# EAGLE design turntouch-remote-master (EAGLE 7.3.0)
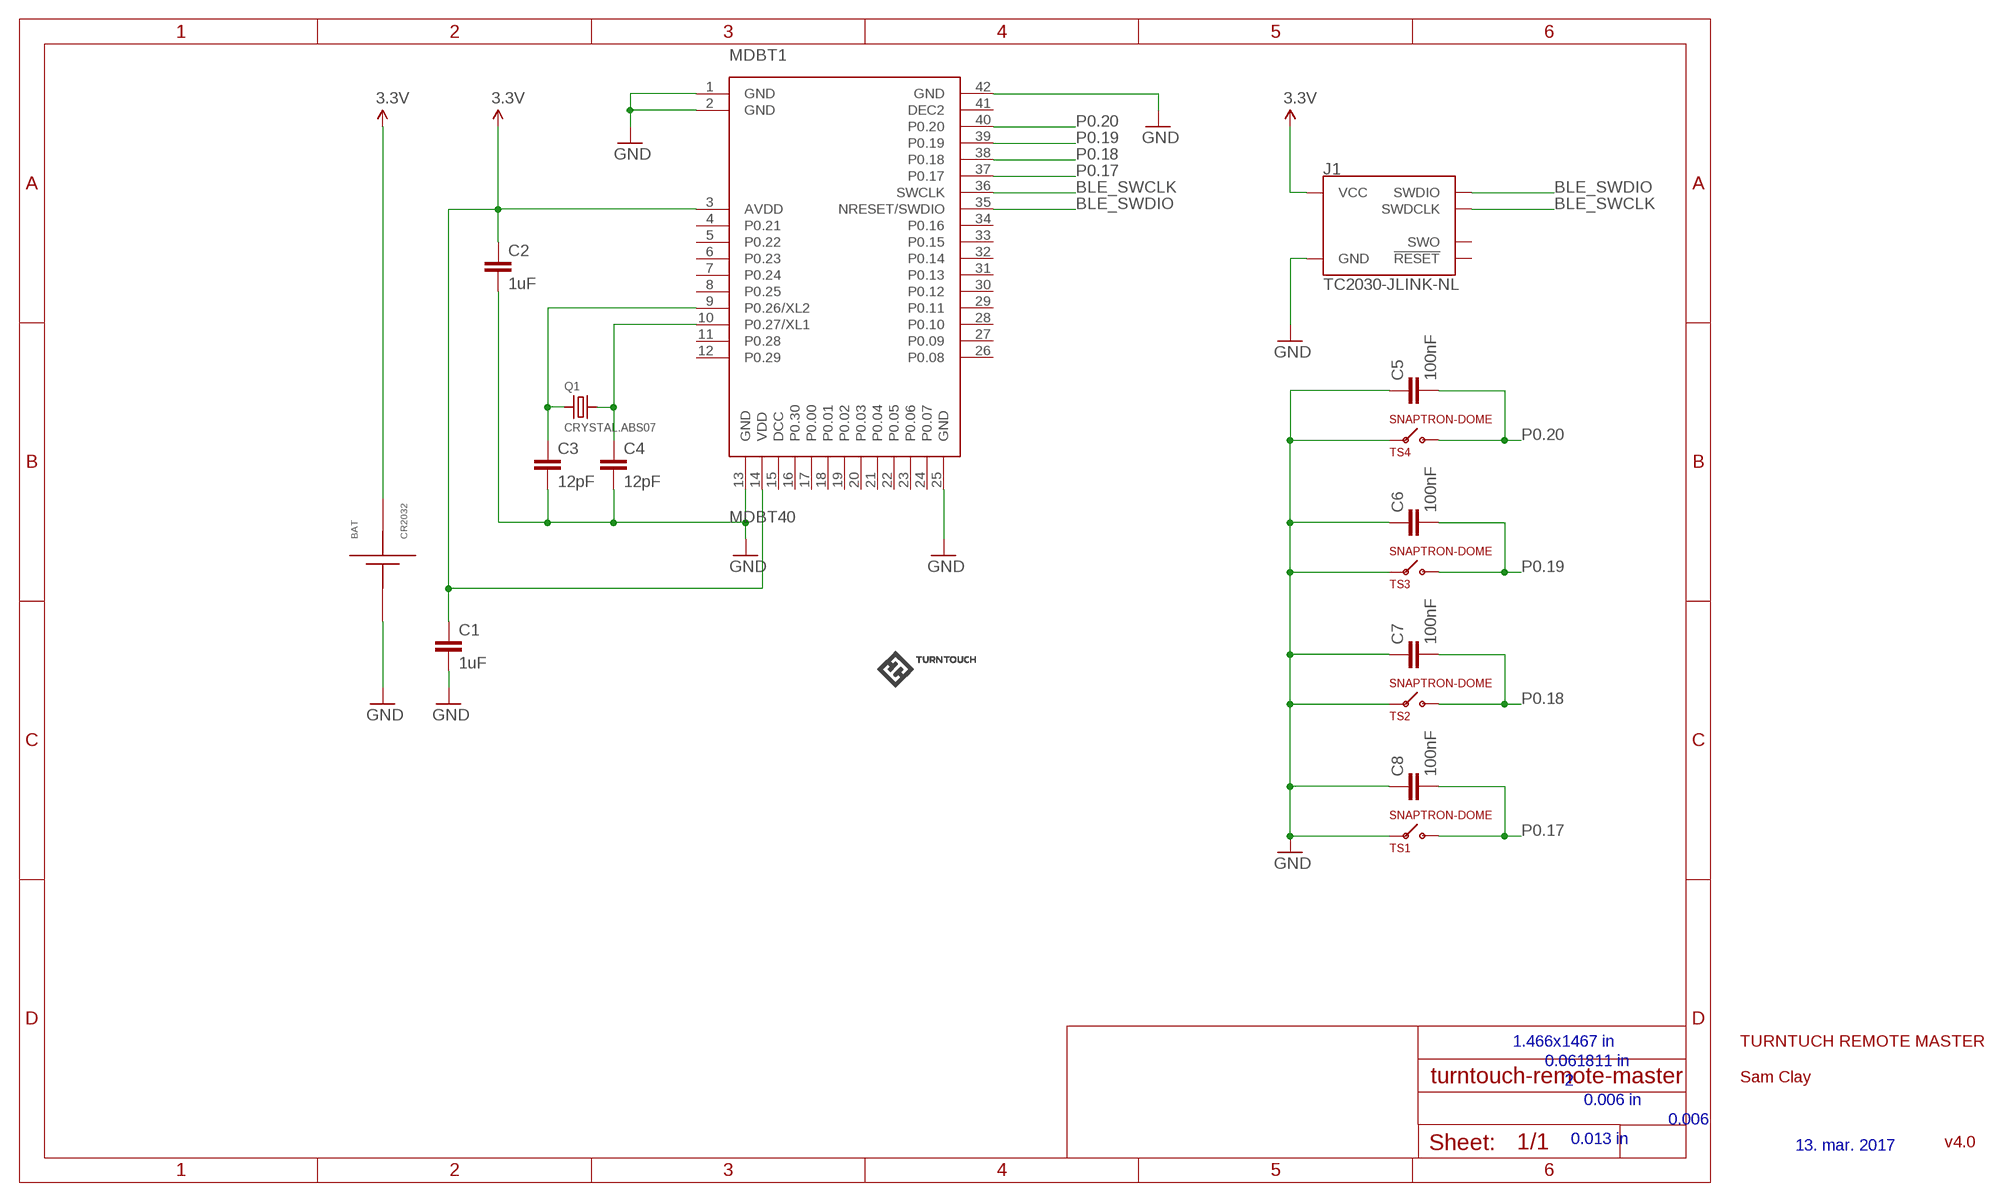
[diagram p0: schematic, sheet 1]

## Parts
BAT  CR2032  [CR2032]
C1  1uF  0.1UF-25V(+80/-20%)(0603)  [0603-CAP]
C2  1uF  0.1UF-25V(+80/-20%)(0603)  [0603-CAP]
C3  12pF  0.1UF-25V(+80/-20%)(0603)  [0603-CAP]
C4  12pF  0.1UF-25V(+80/-20%)(0603)  [0603-CAP]
C5  100nF  0.1UF-25V(+80/-20%)(0603)  [0603-CAP]
C6  100nF  0.1UF-25V(+80/-20%)(0603)  [0603-CAP]
C7  100nF  0.1UF-25V(+80/-20%)(0603)  [0603-CAP]
C8  100nF  0.1UF-25V(+80/-20%)(0603)  [0603-CAP]
J1  TC2030-JLINK-NL  [TC2030-IDC-NL]
LOGO  TURNTOUCHLOGO200DPI  [LOGO]
MDBT1  MDBT40  [MDBT40]
Q1  CRYSTAL.ABS07  [ABS07]
TS1  SNAPTRON-DOME  [DOME-M-SERIES]
TS2  SNAPTRON-DOME  [DOME-M-SERIES]
TS3  SNAPTRON-DOME  [DOME-M-SERIES]
TS4  SNAPTRON-DOME  [DOME-M-SERIES]

## Nets
3.3V [power]: BAT.P$1(VBAT) BAT.P$2(VBAT) C1.1 C2.1 J1.1(VCC) MDBT1.3(AVDD) MDBT1.14(VDD)
BLE_SWCLK: J1.4(SWDCLK) MDBT1.36(SWCLK)
BLE_SWDIO: J1.2(SWDIO) MDBT1.35(NRESET/SWDIO)
C5: C4.1 MDBT1.10(P0.27/XL1) Q1.2
GND: BAT.GND C1.2 C2.2 C3.2 C4.2 C5.1 C6.1 C7.1 C8.1 J1.5(GND) MDBT1.1(GND) MDBT1.2(GND) MDBT1.13(GND) MDBT1.25(GND) MDBT1.42(GND) TS1.P$1(V) TS1.P$2(V) TS2.P$1(V) TS2.P$2(V) TS3.P$1(V) TS3.P$2(V) TS4.P$1(V) TS4.P$2(V)
N$13: C3.1 MDBT1.9(P0.26/XL2) Q1.1
P0.17: C8.2 MDBT1.37(P0.17) TS1.P$3(B)
P0.18: C7.2 MDBT1.38(P0.18) TS2.P$3(B)
P0.19: C6.2 MDBT1.39(P0.19) TS3.P$3(B)
P0.20: C5.2 MDBT1.40(P0.20) TS4.P$3(B)
Unconnected: J1.3(!RESET) J1.6(SWO) MDBT1.4(P0.21) MDBT1.5(P0.22) MDBT1.6(P0.23) MDBT1.7(P0.24) MDBT1.8(P0.25) MDBT1.11(P0.28) MDBT1.12(P0.29) MDBT1.15(DCC) MDBT1.16(P0.30) MDBT1.17(P0.00) MDBT1.18(P0.01) MDBT1.19(P0.02) MDBT1.20(P0.03) MDBT1.21(P0.04) MDBT1.22(P0.05) MDBT1.23(P0.06) MDBT1.24(P0.07) MDBT1.26(P0.08) MDBT1.27(P0.09) MDBT1.28(P0.10) MDBT1.29(P0.11) MDBT1.30(P0.12) MDBT1.31(P0.13) MDBT1.32(P0.14) MDBT1.33(P0.15) MDBT1.34(P0.16) MDBT1.41(DEC2)

## Notes on the sheet
- 1.466x1467 in | TURNTUCH REMOTE MASTER
- 0.061811 in
- 2 | Sam Clay
- 0.006 in
- 0.006
- 0.013 in | v4.0
- 13. mar. 2017

## Library data of the parts
BAT = cr2032:CR2032
C1-C8 = SparkFun-Capacitors:0.1UF-25V(+80/-20%)(0603): CAP-00810 Ceramic Standard decoupling cap; PROD_ID: CAP-00810; VALUE: 0.1uF
J1 = connector:TC2030-JLINK
LOGO = remote:TURNTOUCHLOGO
MDBT1 = MDBT40_170726:MDBT40: Raytac Corporation MDBT40-256V3(16Kb), MDBT40-P256V3(16Kb), MDBT40-256RV3(32Kb), MDBT40-P256RV3(32Kb), Bluetooth Low Energy Module based on Noridc nRF51822 Source: Raytac datasheet
Q1 = abracon:CRYSTAL
TS1-TS4 = remote:SNAPTRON-DOME

## Net classes
0 default: width 0.102 mm, drill 0.203 mm, clearance 0.102 mm
1 power: width 0.254 mm, drill 0.33 mm, clearance 0.152 mm

## Board
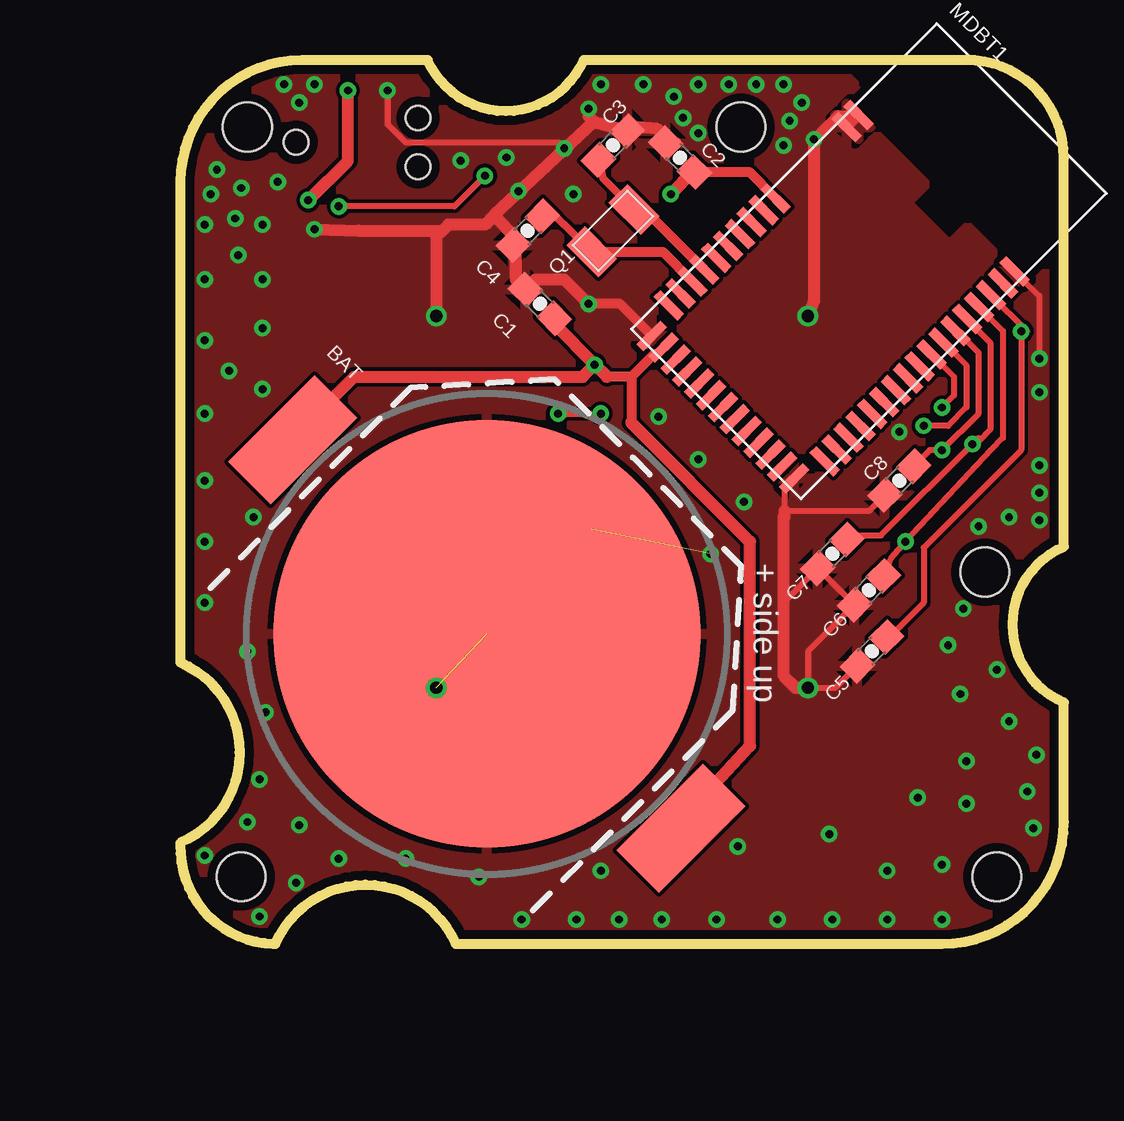
[diagram p1: board, top side]
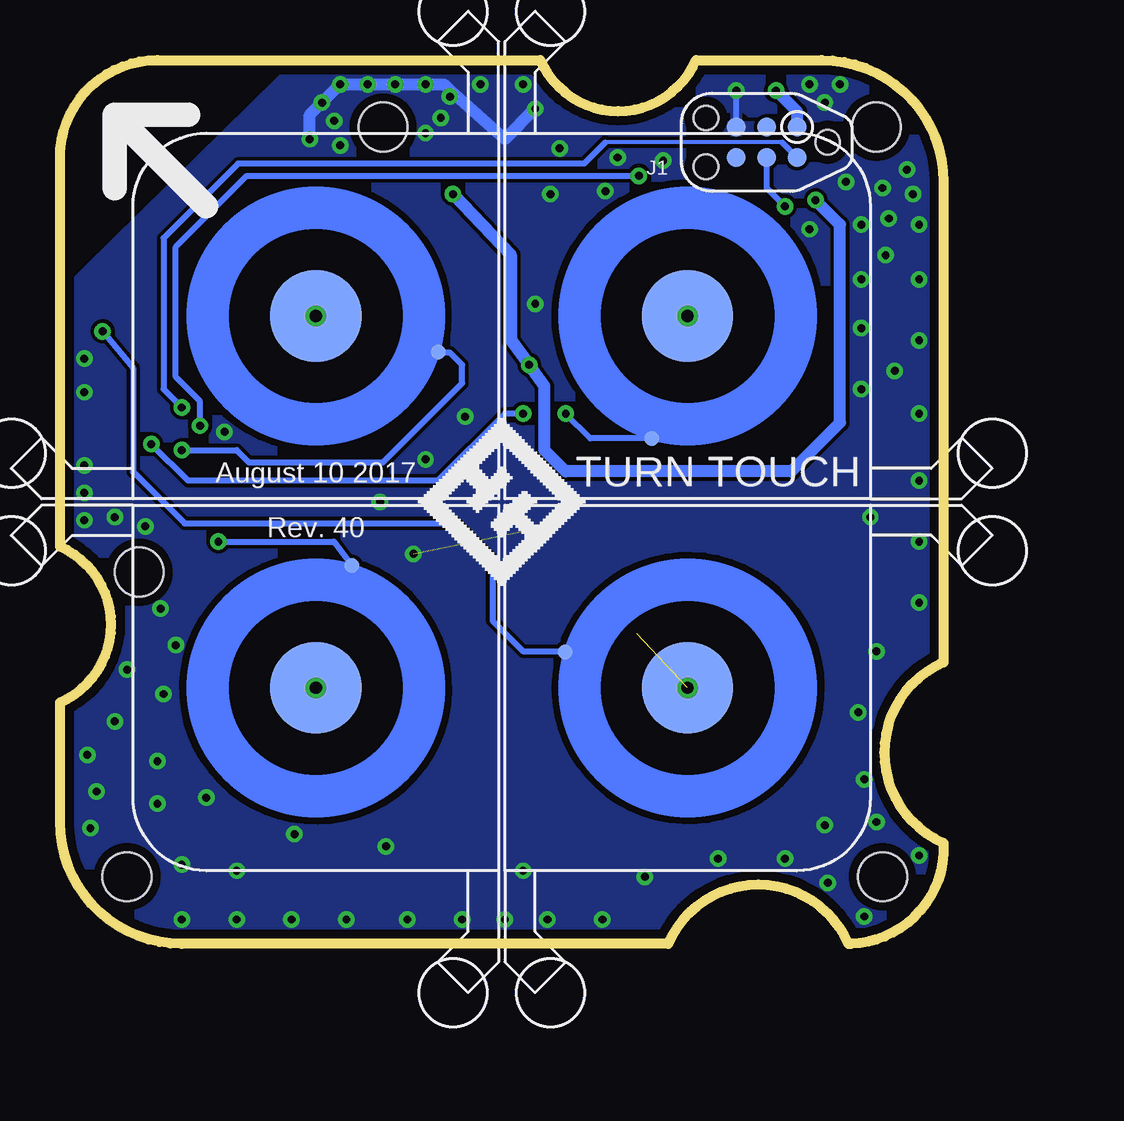
[diagram p2: board, bottom side, seen from below]

Size 36.83 x 36.83 mm. Coordinates in mm from the lower left corner, seen from the top.
Outline: 0,31.75 0,11.73 arc-133 0,4.21 0,4.13 arc90 3.87,0 3.96,0 arc-133 11.48,0 31.75,0 arc90 36.83,5.08 36.83,10.06 arc-133 36.83,16.56 36.83,32.77 arc90 32.77,36.83 16.81,36.83 arc-133 10.31,36.83 5.08,36.83 arc90 0,31.75
Copper layers (1*16): Top 0.0356mm / dielectric 1.5011mm / Bottom 0.0356mm
Design rules "OSHPark *": minimum track width 6mil, minimum drill 13mil, track to track 6mil, track to pad 6mil, pad to pad 6mil, via to via 6mil, smd to smd 0mil, copper to edge 15mil, drill to drill 6mil, minimum pad ring 7mil, minimum via ring 7mil, stop-mask expansion 3mil, vias tented up to drill 0mil, thermal gap 10mil
Holes 2.03 mm at 2.79,34.04 34.04,2.79 23.37,34.04 2.54,2.79 33.53,15.49

### Footprints (pad centres in the part's own frame; a part is rotated, then mirrored left to right if it is on the bottom)
CR2032 = smd 17.8 x 17.8: GND 0,0 | smd 2.5 x 5.1: P$1 -11.45,0; P$2 11.45,0
0603-CAP = smd 1.1 x 1: 1 -0.85,0; 2 0.85,0
TC2030-IDC-NL = smd 0.787 x 0.787: 1 -1.27,-0.635; 2 -1.27,0.635; 3 0,-0.635; 4 0,0.635; 5 1.27,-0.635; 6 1.27,0.635 | hole 1.016: -2.54,0; 2.54,1.016; 2.54,-1.016
MDBT40 = smd 1.4 x 0.4: 1 -4.6,4; 2 -4.6,3.3; 3 -4.6,-0.9; 4 -4.6,-1.6; 5 -4.6,-2.3; 6 -4.6,-3; 7 -4.6,-3.7; 8 -4.6,-4.4; 9 -4.6,-5.1; 10 -4.6,-5.8; 11 -4.6,-6.5; 12 -4.6,-7.2; 26 4.6,-7.2; 27 4.6,-6.5; 28 4.6,-5.8; 29 4.6,-5.1; 30 4.6,-4.4; 31 4.6,-3.7; 32 4.6,-3; 33 4.6,-2.3; 34 4.6,-1.6; 35 4.6,-0.9; 36 4.6,-0.2; 37 4.6,0.5; 38 4.6,1.2; 39 4.6,1.9; 40 4.6,2.6; 41 4.6,3.3; 42 4.6,4 | smd 0.4 x 1.4: 13 -4.2,-8.6; 14 -3.5,-8.6; 15 -2.8,-8.6; 16 -2.1,-8.6; 17 -1.4,-8.6; 18 -0.7,-8.6; 19 0,-8.6; 20 0.7,-8.6; 21 1.4,-8.6; 22 2.1,-8.6; 23 2.8,-8.6; 24 3.5,-8.6; 25 4.2,-8.6
ABS07 = smd 1.1 x 1.9: 1 -1.25,0; 2 1.25,0
DOME-M-SERIES = smd 3.81 x 3.81: P$1 0,0 | drill 0.508 pad 0.762: P$2 0,0 | smd 0.635 x 0.635: P$3 5.095,-1.501

### Placement (x,y rotation side)
BAT  12.78,12.92 315 top
C1  14.99,26.67 135 top
C2  20.83,32.77 135 top
C3  18.03,33.27 45 top
C4  14.48,29.72 225 top
C5  28.83,12.19 45 top
C6  28.7,14.73 45 top
C7  27.18,16.26 45 top
C8  29.97,19.3 45 top
J1  7.37,33.4 180 bottom
LOGO  21.84,14.99 0 bottom
MDBT1  28.7,28.45 315 top
Q1  18.03,29.72 225 top
TS1  26.16,26.16 0 bottom
TS2  10.67,26.16 270 bottom
TS3  26.16,10.67 90 bottom
TS4  10.67,10.67 180 bottom

### Tracks (layer width: path | path; a pad name or v marks a point on that pad's centre or on a via)
3.3V  (via drill 0.33)
  Top 0.406: C2.1 23.71,32.16 MDBT1.3 | 18.8,23.62 19.74,24.56 19.87,24.56 MDBT1.14 | 18.8,23.62 17.78,23.62 | 18.8,23.62 18.8,21.72
  Top 0.508: 17.78,23.62 v17.27,24.13 | BAT.P$1 4.68,21.06 7.24,23.62 16.76,23.62 v17.27,24.13 | C1.1 15.59,25.82 v17.27,24.13 | BAT.P$2 20.87,5.12 23.75,8.26 23.75,16.76 18.8,21.72 | v20.45,31.24 21.37,32.16 C2.1 | v5.33,30.99 6.99,32.64 v6.99,35.56
  Bottom 0.508: v20.45,31.24 18.03,28.7 18.03,25.15 v17.27,24.13 16.64,23.24 16.64,20.57 15.75,19.68 6.35,19.68 4.32,21.72 4.32,29.97 v5.33,30.99 | J1.1 6.1,34.67 v6.99,35.56
BLE_SWCLK  (via drill 0.33)
  Top 0.254: MDBT1.36 32.77,24.1 32.77,22.35 32,21.59 v30.99,21.59 | v12.7,32 11.43,30.73 v6.6,30.73
  Bottom 0.254: v30.99,21.59 30.99,22.61 32,23.62 32,29.04 29.04,32 v12.7,32 | v6.6,30.73 7.37,31.5 J1.4
BLE_SWDIO  (via drill 0.33 pad 0.25)
  Top 0.254: v31.75,22.35 32.26,22.86 32.26,23.62 MDBT1.35
  Bottom 0.175: 6.73,33.4 14.1,33.4
  Bottom 0.254: J1.2 6.73,33.4 | 14.1,33.4 14.99,32.51 29.41,32.51 32.51,29.41 32.51,23.11 v31.75,22.35
C5
  Top 0.254: C4.1 15.41,30.57
  Top 0.305: 15.41,30.57 15.41,30.56 16,29.97 16.01,29.97 Q1.2
  Top 0.406: Q1.2 20.11,28.83 MDBT1.10
GND  (via drill 0.33)  (2 unrouted)
  Top 0.254: 20.65,33.37 C2.2 | C8.1 28.7,18.03 25.18,18.03 25.18,18.99 MDBT1.25 | 25.15,14.22 C7.1 C6.1 26.16,12.19 TS3.P$1 27.3,10.67 C5.1 | MDBT1.42 35.81,26.99 v35.81,24.38 | v8.64,35.56 8.64,34.16 9.4,33.4 15.75,33.4 v16,33.15 | v5.59,29.78 5.59,29.72
  Top 0.406: MDBT1.13 18.32,26.67 v17.02,26.67 | v26.42,33.53 27.42,34.53 MDBT1.1 MDBT1.2
  Top 0.508: TS2.P$1 10.67,29.46 10.92,29.72 | v17.02,34.8 17.02,34.48 17.24,34.26 | 17.24,34.26 C3.2 19.05,34.04 19.89,33.96 20.65,33.37 | 17.24,34.26 13.08,30.35 | 13.08,30.35 12.7,29.97 11.18,29.97 10.92,29.72 | v5.59,29.78 7.43,29.72 10.92,29.72 | 13.08,30.35 14.06,29.37 C4.2 13.88,29.07 13.98,28.96 13.98,27.68 C1.2 | v26.42,33.53 26.42,26.8 TS1.P$1 | 25.18,18.03 25.18,17.82 25.15,17.78 25.15,14.22 25.15,11.18 25.65,10.67 TS3.P$1 | C1.2 14.38,27.34 | 17.13,17.27 BAT.GND | C1.2 14.8,27.69 16,27.69 v17.02,26.67
  Bottom 0.254: J1.5 v8.64,35.56
  Bottom 0.508: v26.42,33.53 26.42,34.54 v25.15,35.81 20.83,35.81 20.57,35.56 18.29,33.53 v17.02,34.8
  other vias: 24,35.81 35.81,18.8 32.64,13.97 35.69,7.87 32.77,5.84 34.04,11.43 32.77,7.62 35.31,6.35 35.56,4.83 29.46,3.05 31.75,1.02 29.46,1.02 27.18,1.02 24.89,1.02 22.35,1.02 20.07,1.02 14.22,1.02 16.51,1.02 18.29,1.02 12.45,2.79 9.4,3.56 6.6,3.56 4.83,2.54 3.3,1.14 1.02,3.68 2.79,5.08 3.3,6.86 3.56,9.65 2.79,12.19 1.02,14.22 1.02,16.76 1.02,19.3 1.02,22.1 1.02,25.15 1.02,27.69 1.02,29.97 1.27,31.24 2.54,31.5 4.32,35.81 5.59,35.81 2.03,23.88 2.29,30.23 11.68,32.64 13.59,32.77 17.53,35.81 19.3,35.81 25.91,35.05 25.15,33.27 22.86,35.81 21.59,33.78 20.57,35.31 29.97,21.34 33.27,17.4 35.81,17.65 34.54,17.78 16.38,31.24 32,12.45 32.51,10.41 30.73,6.1 27.05,4.57 4.95,35.05 23.24,4.06 17.53,3.05 4.95,4.95 2.41,28.7 1.52,32.26 4.06,31.75 3.43,29.97 3.43,27.69 35.81,22.99 35.81,19.94 19.94,21.97 23.5,18.41 21.59,20.19 34.54,9.27 20.95,34.42 25.4,34.29 21.59,35.81 14.1,31.37 22.1,16.26 31.75,3.3 3.43,25.65 3.43,23.11 3.05,17.78
  pour Bottom: -1.02,-0.76 37.59,-0.76 37.97,25.78 25.27,38.23 -1.02,37.85
  pour Top: -1.78,38.61 25.15,38.73 38.86,25.27 38.35,-1.52 -1.78,-1.52
N$13
  Top 0.305: C3.1 17.61,31.91 Q1.1
  Top 0.406: MDBT1.9 19.34,30.6 Q1.1
P0.17  (via drill 0.33)
  Top 0.254: C8.2 31.24,20.57 v31.75,20.57 33.27,22.1 33.27,24.64 32.52,25.39
  Top 0.406: MDBT1.37 32.46,25.39 32.52,25.39
  Bottom 0.254: v31.75,20.57 29.46,20.57 28.96,20.07 23.37,20.07 20.07,23.37 20.07,24.13 20.57,24.64 21.05,24.64 TS1.P$3
P0.18  (via drill 0.33)
  Top 0.254: C7.2 27.69,16.51 28.19,17.02 29.21,17.02 v33.02,20.83 33.27,21.08 33.27,20.95 33.78,21.46 33.78,25.02 32.8,26 MDBT1.38 | v15.75,22.1 v17.53,22.1
  Bottom 0.254: v33.02,20.83 31.5,19.3 21.08,19.3 18.29,22.1 v17.53,22.1 | TS2.P$3 14.72,21.07 v15.75,22.1
P0.19  (via drill 0.33)
  Top 0.254: C6.2 29.63,16.09 v30.23,16.76 33.78,20.57 34.29,21.08 34.29,25.55 MDBT1.39
  Bottom 0.254: v30.23,16.76 25.41,16.76 TS3.P$3
P0.20  (via drill 0.33)
  Top 0.254: C5.2 29.46,12.7 30.99,14.22 30.99,16.51 35.05,20.57 v35.05,25.53 35.3,25.53 MDBT1.40
  Bottom 0.254: v35.05,25.53 33.78,24 33.78,19.67 31.64,17.53 20.32,17.53 18.8,16 18.8,13.46 17.53,12.19 15.79,12.19 TS4.P$3

### Text on the board
tNames: + side up
bNames: TURN TOUCH | August 10 2017 | Rev. 40